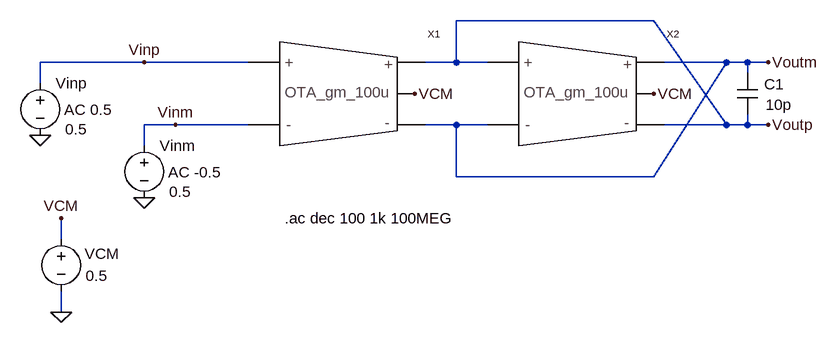
[diagram p0: schematic _Fig3_18_MSD.asc]
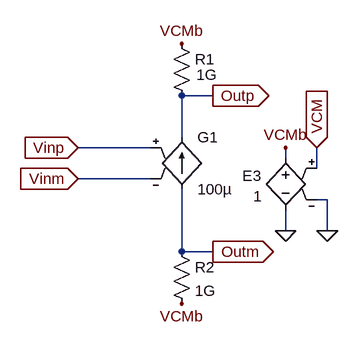
[diagram p1: sub-circuit ota_gm_100u.asc]
_Fig3_18_MSD.asc, the LTspice schematic file:
Version 4
SHEET 1 2748 704
WIRE 1568 -512 1264 -512
WIRE 784 -448 624 -448
WIRE 944 -448 784 -448
WIRE 1264 -448 1264 -512
WIRE 1264 -448 1216 -448
WIRE 1312 -448 1264 -448
WIRE 1680 -448 1584 -448
WIRE 1712 -448 1680 -448
WIRE 1744 -448 1712 -448
WIRE 1712 -432 1712 -448
WIRE 624 -416 624 -448
WIRE 832 -352 784 -352
WIRE 944 -352 832 -352
WIRE 1264 -352 1216 -352
WIRE 1312 -352 1264 -352
WIRE 1680 -352 1568 -512
WIRE 1680 -352 1584 -352
WIRE 1712 -352 1712 -368
WIRE 1712 -352 1680 -352
WIRE 1744 -352 1712 -352
WIRE 784 -320 784 -352
WIRE 1264 -272 1264 -352
WIRE 1568 -272 1680 -448
WIRE 1568 -272 1264 -272
WIRE 656 -176 656 -208
WIRE 656 -64 656 -96
FLAG 656 -64 0
FLAG 656 -208 VCM
FLAG 1744 -448 Voutm
FLAG 1744 -352 Voutp
FLAG 624 -336 0
FLAG 784 -448 Vinp
FLAG 832 -352 Vinm
FLAG 784 -240 0
FLAG 1200 -400 VCM
FLAG 1568 -400 VCM
SYMBOL voltage 656 -192 R0
WINDOW 0 36 38 Left 0
WINDOW 3 38 72 Left 0
SYMATTR InstName VCM
SYMATTR Value 0.5
SYMBOL voltage 624 -432 R0
WINDOW 3 38 87 Left 0
WINDOW 123 37 57 Left 0
WINDOW 39 0 0 Left 0
SYMATTR Value 0.5
SYMATTR Value2 AC 0.5
SYMATTR InstName Vinp
SYMBOL voltage 784 -336 R0
WINDOW 3 38 87 Left 0
WINDOW 123 37 57 Left 0
WINDOW 39 0 0 Left 0
SYMATTR Value 0.5
SYMATTR Value2 AC -0.5
SYMATTR InstName Vinm
SYMBOL OTA_gm_100u 992 -400 R0
SYMATTR InstName X1
SYMBOL OTA_gm_100u 1360 -400 R0
SYMATTR InstName X2
SYMBOL cap 1696 -432 R0
WINDOW 0 42 18 Left 0
WINDOW 3 44 49 Left 0
SYMATTR InstName C1
SYMATTR Value 10p
TEXT 1000 -208 Left 0 !.ac dec 100 1k 100MEG

ota_gm_100u.asc, the sub-circuit schematic file:
Version 4
SHEET 1 6300 744
WIRE 1488 384 1376 384
WIRE 1488 432 1376 432
WIRE 1536 368 1536 304
WIRE 1536 544 1536 448
WIRE 1584 304 1536 304
WIRE 1584 544 1536 544
WIRE 1696 400 1696 384
WIRE 1696 512 1696 480
WIRE 1744 416 1744 384
WIRE 1760 464 1744 464
WIRE 1760 512 1760 464
FLAG 1584 304 Outp
IOPIN 1584 304 Out
FLAG 1376 384 Vinp
IOPIN 1376 384 In
FLAG 1376 432 Vinm
IOPIN 1376 432 In
FLAG 1584 544 Outm
IOPIN 1584 544 Out
FLAG 1696 512 0
FLAG 1760 512 0
FLAG 1744 384 VCM
IOPIN 1744 384 In
FLAG 1696 384 VCMb
FLAG 1536 224 VCMb
FLAG 1536 624 VCMb
SYMBOL e 1696 384 M0
WINDOW 0 37 43 Left 0
WINDOW 3 36 75 Left 0
SYMATTR InstName E3
SYMATTR Value 1
SYMBOL g 1536 352 R0
SYMATTR InstName G1
SYMATTR Value 100µ
SYMBOL res 1520 208 R0
WINDOW 3 39 64 Left 0
SYMATTR Value 1G
SYMATTR InstName R1
SYMBOL res 1520 528 R0
SYMATTR InstName R2
SYMATTR Value 1G

The netlist it stands for:
* _Fig3_18_MSD.asc
VCM VCM 0 0.5
Vinp Vinp 0 0.5 AC 0.5
Vinm Vinm 0 0.5 AC -0.5
XX1 Vinm Vinp Voutp VCM Voutm ota_gm_100u
XX2 Voutm Voutp Voutm VCM Voutp ota_gm_100u
C1 Voutm Voutp 10p

* block symbol definitions
.subckt ota_gm_100u Vinm Vinp Outp VCM Outm
E3 VCMb 0 VCM 0 1
G1 Outm Outp Vinp Vinm 100µ
R1 VCMb Outp 1G
R2 Outm VCMb 1G
.ends ota_gm_100u

.ac dec 100 1k 100MEG
.backanno
.end